# EasyEDA schematic SCH_spponpcbfin_2024-06-20.json
TITLE: autostirrer; REV: 1.0; Date: 2024-05-07; Sheet: 1/1; Drawn By: vracto; Company: autostirrer
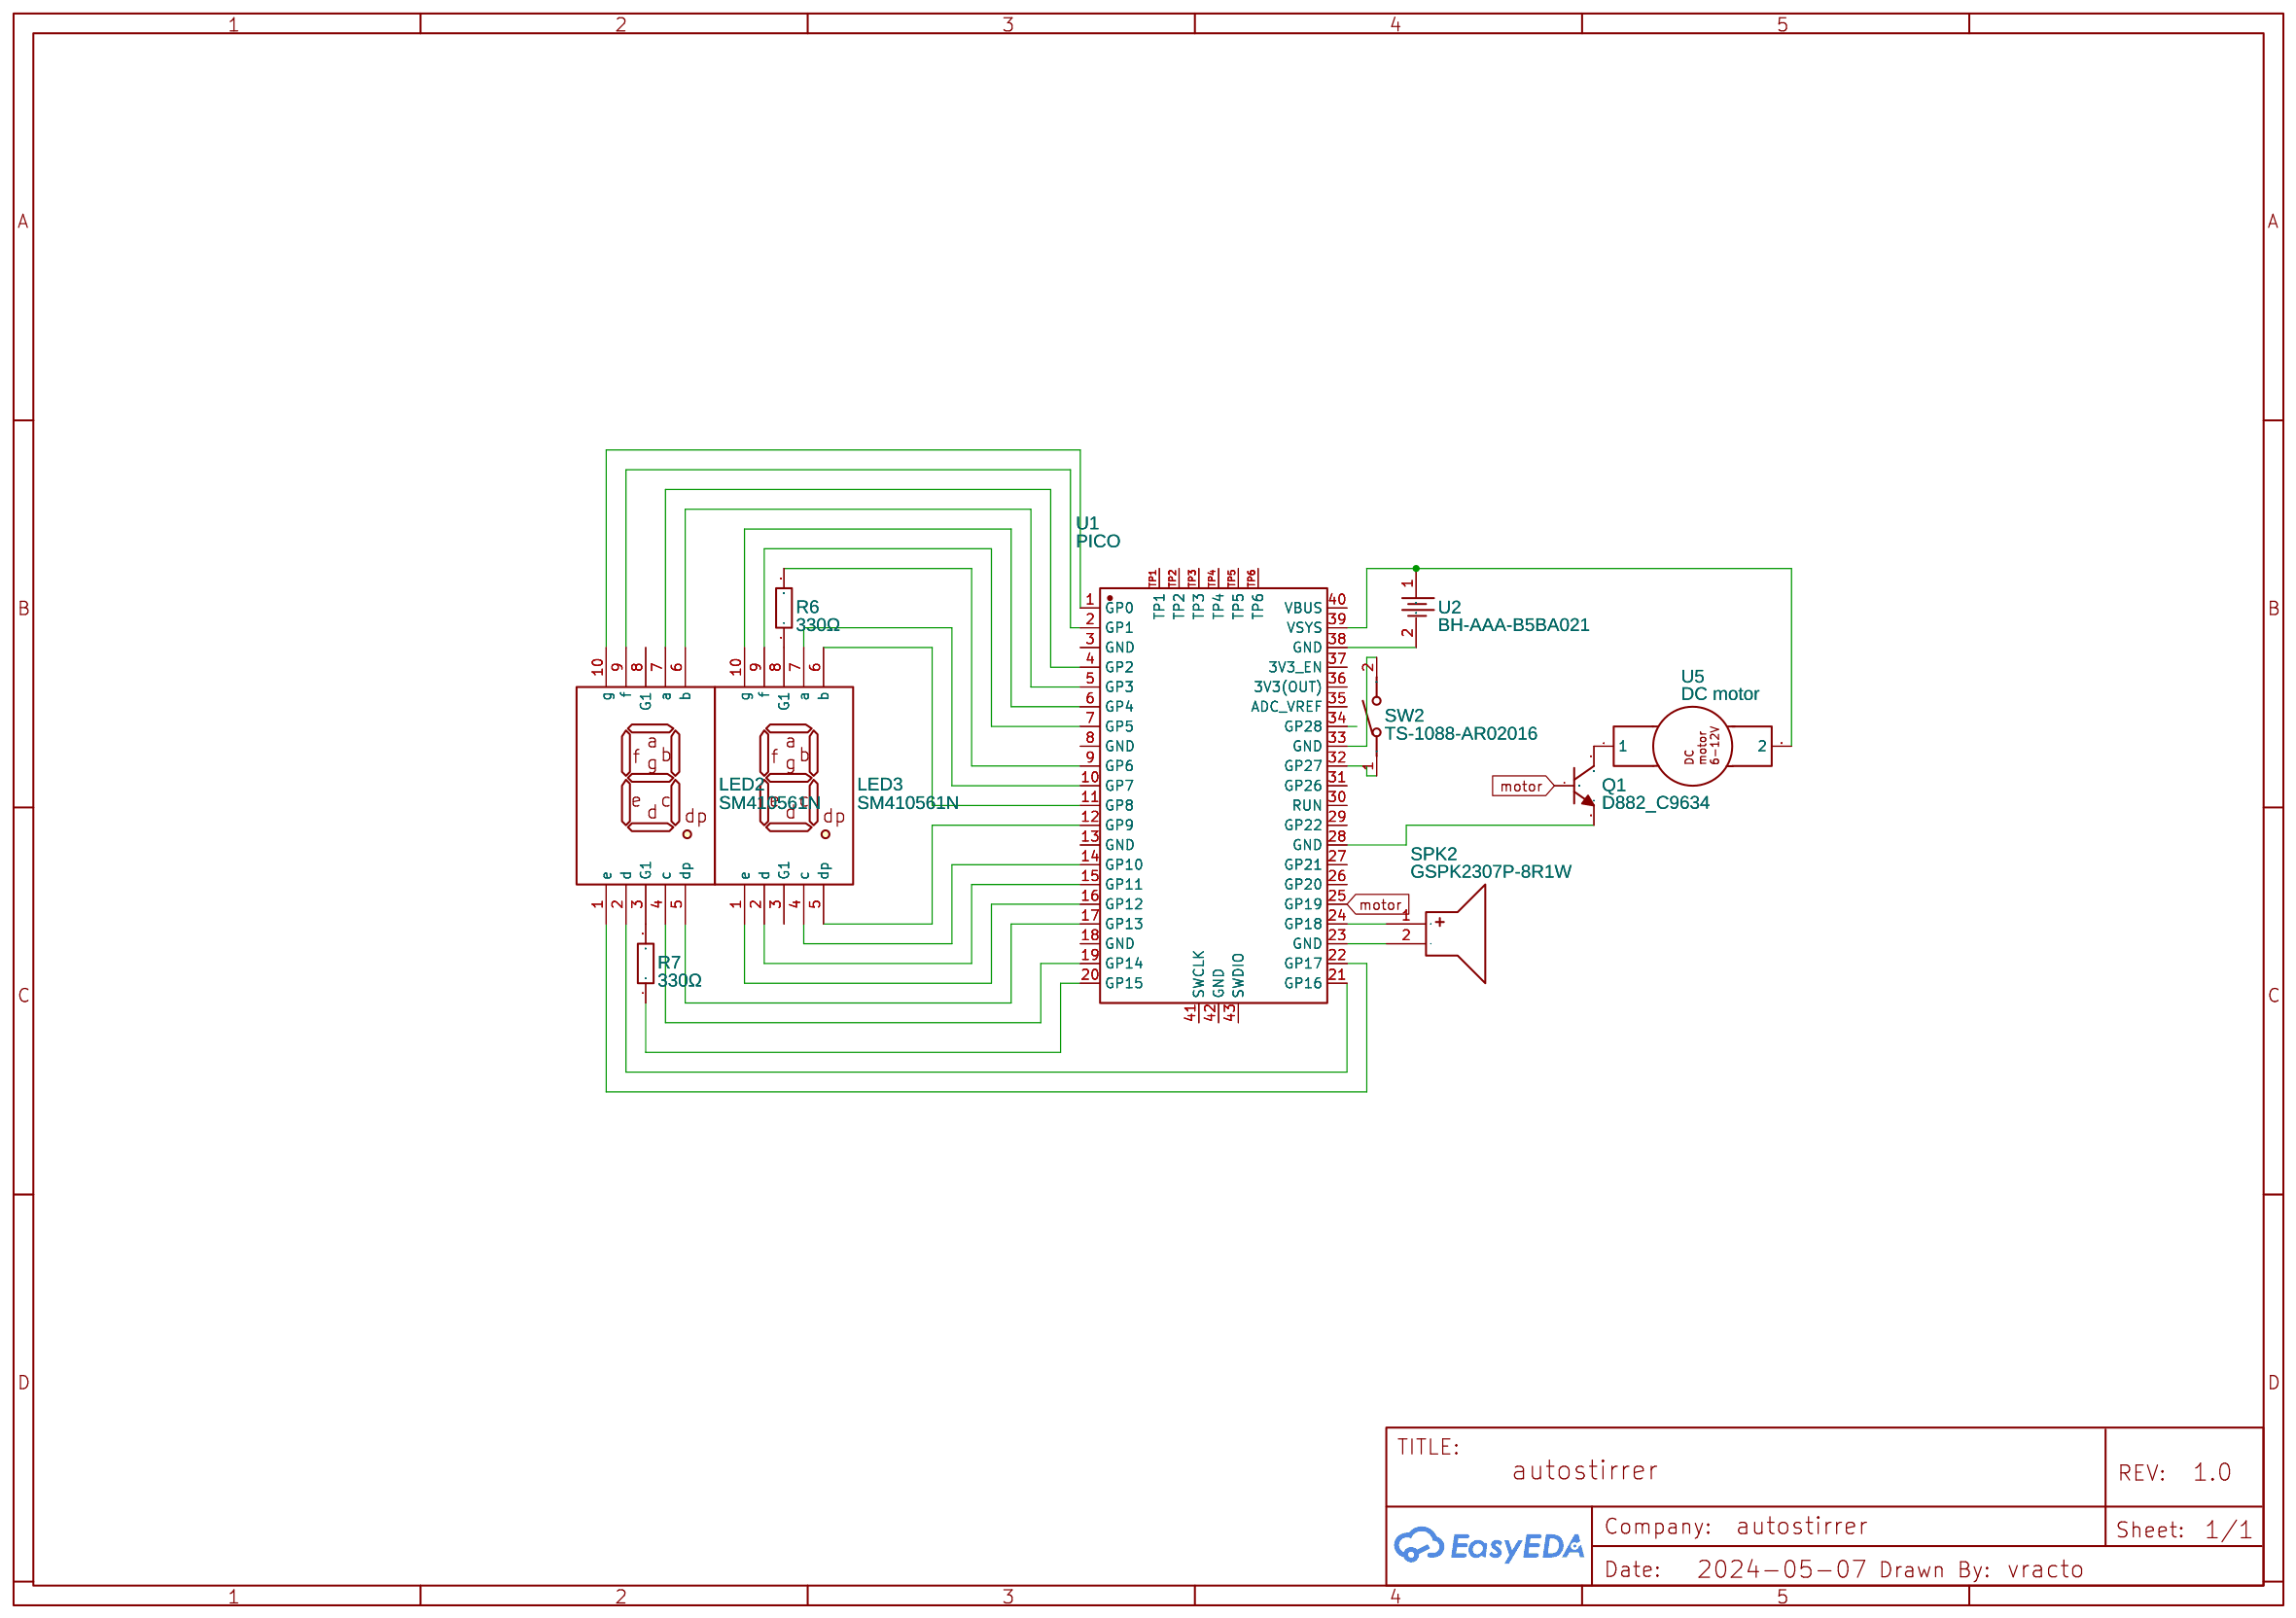
[diagram p0: schematic sheet]

## Parts
LED2  SM410561N  [LED-SEG-TH_10P-L12.7-W19.0-P2.54-S15.24-BL]
LED3  SM410561N  [LED-SEG-TH_10P-L12.7-W19.0-P2.54-S15.24-BL]
Q1  D882_C9634  [SOT-89-3_L4.5-W2.5-P1.50-LS4.2-BR]
R6  330Ω  [RES-TH_BD2.2-L6.5-P10.50-D0.6]
R7  330Ω  [RES-TH_BD2.2-L6.5-P10.50-D0.6]
SPK2  GSPK2307P-8R1W  [SPK-TH_BD23.0-P10.00-D0.8-L-RD]
SW2  TS-1088-AR02016  [SW-SMD_L3.9-W3.0-P4.45]
U1  PICO  [COMM-SMD_L51.0-W21.0-P2.54_SC0916]
U2  BH-AAA-B5BA021  [BAT-SMD_BH-AAA-B5BA021]
U5  DC motor  [MOTOR1]

## Library data of the parts
LED2 LED3 = SM410561N: Contributor: LCSC; Supplier: LCSC; Manufacturer: ARKLED(方舟); Supplier Part: C141368; JLCPCB Part Class: Extended Part
Q1 = D882_C9634: Supplier: LCSC; Manufacturer: CJ(江苏长电/长晶); Manufacturer Part: D882 Y档160~320; Supplier Part: C9634; JLCPCB Part Class: Basic Part
R6 R7 = MFR-25FTE52-330R: Contributor: LCSC; Supplier: LCSC; Manufacturer: YAGEO(国巨); Supplier Part: C138208; JLCPCB Part Class: Extended Part
SPK2 = GSPK2307P-8R1W: Contributor: LCSC; Supplier: LCSC; Supplier Part: C530531; Manufacturer: INGHAi(赢海); JLCPCB Part Class: Extended Part
SW2 = TS-1088-AR02016: Contributor: LCSC; Supplier: LCSC; Supplier Part: C720477; Manufacturer: XUNPU(讯普); JLCPCB Part Class: Extended Part
U1 = PICO: Supplier: LCSC; Supplier Part: C7203002; Manufacturer: Raspberry Pi(树莓派); JLCPCB Part Class: Extended Part; Contributor: lcsc
U2 = BH-AAA-B5BA021: Supplier: LCSC; Supplier Part: C7525446; Manufacturer: MYOUNG(美阳); JLCPCB Part Class: Extended Part; Contributor: lcsc
U5 = -: Contributor: danielagrell.1; Manufacturer Part: ?

## Nets
motor: Q1.1(B) U1.25(GP19)
Net-(LED2-1): LED2.1(e) U1.22(GP17)
Net-(LED2-2): LED2.2(d) U1.21(GP16)
Net-(LED2-3): LED2.3(G1) R7.2
Net-(LED2-4): LED2.4(c) U1.19(GP14)
Net-(LED2-5): LED2.5(dp) U1.17(GP13)
Net-(LED2-6): LED2.6(b) U1.5(GP3)
Net-(LED2-7): LED2.7(a) U1.4(GP2)
Net-(LED2-9): LED2.9(f) U1.2(GP1)
Net-(LED2-10): LED2.10(g) U1.1(GP0)
Net-(LED3-1): LED3.1(e) U1.16(GP12)
Net-(LED3-2): LED3.2(d) U1.15(GP11)
Net-(LED3-4): LED3.4(c) U1.14(GP10)
Net-(LED3-5): LED3.5(dp) U1.12(GP9)
Net-(LED3-6): LED3.6(b) U1.11(GP8)
Net-(LED3-7): LED3.7(a) U1.10(GP7)
Net-(LED3-8): LED3.8(G1) R6.1
Net-(LED3-9): LED3.9(f) U1.7(GP5)
Net-(LED3-10): LED3.10(g) U1.6(GP4)
Net-(Q1-2): Q1.2(C) U5.1
Net-(Q1-3): Q1.3(E) U1.28(GND)
Net-(R6-2): R6.2 U1.9(GP6)
Net-(R7-1): R7.1 U1.20(GP15)
Net-(SPK2-1): SPK2.1(+) U1.24(GP18)
Net-(SPK2-2): SPK2.2(-) U1.23(GND)
Net-(SW2-1): SW2.1 U1.32(GP27)
Net-(SW2-2): SW2.2 U1.33(GND)
Net-(U1-38): U1.38(GND) U2.2
Net-(U1-39): U1.39(VSYS) U2.1 U5.2

Not connected (* = marked no-connect by the designer): LED2 8(G1); LED3 3(G1); U1 3(GND) 8(GND) 13(GND) 18(GND) 26(GP20) 27(GP21) 29(GP22) 30(RUN) 31(GP26) 34(GP28) 35(ADC_VREF) 36(3V3(OUT)) 37(3V3_EN) 40(VBUS) 41(SWCLK) 42(GND) 43(SWDIO) TP1 TP2 TP3 TP4 TP5 TP6
